# EAGLE design E104-BT11G-PCB (EAGLE 9.6.2)
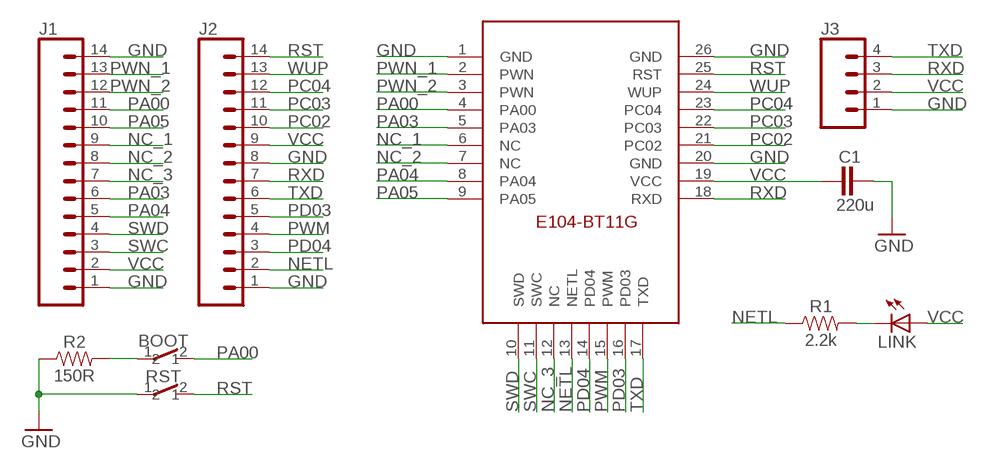
[diagram p0: schematic, sheet 1]

## Parts
BOOT  SKRKAEE010  [SKRK]
C1  220u  C_TANTALUM-1411(3528-METRIC)  [CAPM3528X210]
J1  CONN_14NO_SILK  [1X14_NO_SILK]
J2  CONN_14NO_SILK  [1X14_NO_SILK]
J3  CONN_041X04_NO_SILK  [1X04_NO_SILK]
LINK  LEDCHIP-LED0603  [CHIP-LED0603]
R1  2.2k  2.2KOHM-0603-1/10W-1%  [0603]
R2  150R  2.2KOHM-0603-1/10W-1%  [0603]
RST  SKRKAEE010  [SKRK]
U$1  E104-BT11G-PCBPCB  [E104-BT11G-PCB]

## Nets
GND: C1.2 J1.1 J1.14 J2.1 J2.8 J3.1 R2.1 RST.1 U$1.1(GND) U$1.20(GND) U$1.26(GND)
N$1: LINK.C R1.2
N$2: BOOT.1 R2.2
NC_1: J1.9 U$1.6(NC)
NC_2: J1.8 U$1.7(NC)
NC_3: J1.7 U$1.12(NC)
NETL: J2.2 R1.1 U$1.13(NETL)
PA00: BOOT.2 J1.11 U$1.4(PA00)
PA03: J1.6 U$1.5(PA03)
PA04: J1.5 U$1.8(PA04)
PA05: J1.10 U$1.9(PA05)
PC02: J2.10 U$1.21(PC02)
PC03: J2.11 U$1.22(PC03)
PC04: J2.12 U$1.23(PC04)
PD03: J2.5 U$1.16(PD03)
PD04: J2.3 U$1.14(PD04)
PWM: J2.4 U$1.15(PWM)
PWN_1: J1.13 U$1.2(PWN)
PWN_2: J1.12 U$1.3(PWN)
RST: J2.14 RST.2 U$1.25(RST)
RXD: J2.7 J3.3 U$1.18(RXD)
SWC: J1.3 U$1.11(SWC)
SWD: J1.4 U$1.10(SWD)
TXD: J2.6 J3.4 U$1.17(TXD)
VCC: C1.1 J1.2 J2.9 J3.2 LINK.A U$1.19(VCC)
WUP: J2.13 U$1.24(WUP)

## Library data of the parts
BOOT RST = button3:SKRKAEE010: Tactile Switches 3.9x2.9x2.0mm 160gf Packaging Temp 60oC <https://componentsearchengine.com/Images/1/SKRKAEE010.jpg> Source: Datasheet <http://www.mouser.com/ds/2/15/SKRK-1110686.pdf> Check availability <https://pricing.snapeda.com/parts/SKRKAEE010/ALPS/view-part?ref=eda>; AVAILABILITY: Not in stock; DESCRIPTION: Switch Tactile N.O. SPST Round Button Gull Wing 0.05A 12VDC 1.57N SMD T/R; MF: ALPS; MP: SKRKAEE010; PACKAGE: None; PRICE: None
C1 = Capacitor:C: Capacitor - Generic; CATEGORY: Capacitor
J1 J2 = SparkFun-Connectors:CONN_14: Multi connection point. Often used as Generic Header-pin footprint for 0.1 inch spaced/style header connections On any of the 0.1 inch spaced packages, you can populate with these: Break Away Headers - Straight <https://www.sparkfun.com/products/116> (PRT-00116) Break Away Male Headers - Right Angle <https://www.sparkfun.com/products/553> (PRT-00553) Female Headers <https://www.sparkfun.com/products/115> (PRT-00115) Break Away Headers - Machine Pin <https://www.sparkfun.com/products/117> (PRT-00117) Break Away Female Headers - Swiss Machine Pin <https://www.sparkfun.com/products/743> (PRT-00743) For SCREWTERMINALS and SPRING TERMINALS visit here: Screw Terimnals on SparkFun.com <https://www.sparkfun.com/search/results?term=Screw+Terminals> (5mm/3.5mm/2.54mm spacing) This device is also useful as a general connection point to wire up your design to another part of your project. Our various solder wires solder well into these plated through hole pads. Hook-Up Wire - Assortment (Stranded, 22 AWG) <https://www.sparkfun.com/products/11375> (PRT-11375) Hook-Up Wire - Assortment (Solid Core, 22 AWG) <https://www.sparkfun.com/products/11367> (PRT-11367) View the entire wire category on our website here <https://www.sparkfun.com/categories/141> Special notes: Molex polarized connector foot print use with SKU : PRT-08231 with associated crimp pins and housings. 1MM SMD Version SKU: PRT-10208 NOTES ON THE VARIANTS LOCK and LOCK_LONGPADS... This footprint was designed to help hold the alignment of a through-hole component (i.e. 6-pin header) while soldering it into place. You may notice that each hole has been shifted either up or down by 0.005 of an inch from it's more standard position (which is a perfectly straight line). This slight alteration caused the pins (the squares in the middle) to touch the edges of the holes. Because they are alternating, it causes a "brace" to hold the component in place. 0.005 has proven to be the perfect amount of "off-center" position when using our standard breakaway headers. Although looks a little odd when you look at the bare footprint, once you have a header in there, the alteration is very hard to notice. Also,if you push a header all the way into place, it is covered up entirely on the bottom side.
J3 = SparkFun-Connectors:CONN_04: Multi connection point. Often used as Generic Header-pin footprint for 0.1 inch spaced/style header connections On any of the 0.1 inch spaced packages, you can populate with these: Break Away Headers - Straight <https://www.sparkfun.com/products/116> (PRT-00116) Break Away Male Headers - Right Angle <https://www.sparkfun.com/products/553> (PRT-00553) Female Headers <https://www.sparkfun.com/products/115> (PRT-00115) Break Away Headers - Machine Pin <https://www.sparkfun.com/products/117> (PRT-00117) Break Away Female Headers - Swiss Machine Pin <https://www.sparkfun.com/products/743> (PRT-00743) For SCREWTERMINALS and SPRING TERMINALS visit here: Screw Terimnals on SparkFun.com <https://www.sparkfun.com/search/results?term=Screw+Terminals> (5mm/3.5mm/2.54mm spacing) This device is also useful as a general connection point to wire up your design to another part of your project. Our various solder wires solder well into these plated through hole pads. Hook-Up Wire - Assortment (Stranded, 22 AWG) <https://www.sparkfun.com/products/11375> (PRT-11375) Hook-Up Wire - Assortment (Solid Core, 22 AWG) <https://www.sparkfun.com/products/11367> (PRT-11367) View the entire wire category on our website here <https://www.sparkfun.com/categories/141> Special notes: Molex polarized connector foot print use with SKU : PRT-08231 with associated crimp pins and housings. 1MM SMD Version SKU: PRT-10208; PROD_ID: CONN-09696
LINK = adafruit:LED: LED OSRAM: - CHIPLED LG R971, LG N971, LY N971, LG Q971, LY Q971, LO R971, LY R971 LH N974, LH R974 LS Q976, LO Q976, LY Q976 LO Q996 - Hyper CHIPLED LW Q18S LB Q993, LB Q99A, LB R99A - SideLED LS A670, LO A670, LY A670, LG A670, LP A670 LB A673, LV A673, LT A673, LW A673 LH A674 LY A675 LS A676, LA A676, LO A676, LY A676, LW A676 LS A679, LY A679, LG A679 - Hyper Micro SIDELED® LS Y876, LA Y876, LO Y876, LY Y876 LT Y87S - SmartLED LW L88C, LW L88S LB L89C, LB L89S, LG L890 LS L89K, LO L89K, LY L89K LS L896, LA L896, LO L896, LY L896 - TOPLED LS T670, LO T670, LY T670, LG T670, LP T670 LSG T670, LSP T670, LSY T670, LOP T670, LYG T670 LG T671, LOG T671, LSG T671 LB T673, LV T673, LT T673, LW T673 LH T674 LS T676, LA T676, LO T676, LY T676, LB T676, LH T676, LSB T676, LW T676 LB T67C, LV T67C, LT T67C, LS T67K, LO T67K, LY T67K, LW E67C LS E67B, LA E67B, LO E67B, LY E67B, LB E67C, LV E67C, LT E67C LW T67C LS T679, LY T679, LG T679 LS T770, LO T770, LY T770, LG T770, LP T770 LB T773, LV T773, LT T773, LW T773 LH T774 LS E675, LA E675, LY E675, LS T675 LS T776, LA T776, LO T776, LY T776, LB T776 LHGB T686 LT T68C, LB T68C - Hyper Mini TOPLED® LB M676 - Mini TOPLED Santana® LG M470 LS M47K, LO M47K, LY M47K Source: http://www.osram.convergy.de/
R1 = SparkFun-Resistors:2.2KOHM: 2.2kΩ resistor A resistor is a passive two-terminal electrical component that implements electrical resistance as a circuit element. Resistors act to reduce current flow, and, at the same time, act to lower voltage levels within circuits. - Wikipedia; PROD_ID: RES-08272
R2 = SparkFun-Resistors:2.2KOHM: 2.2kΩ resistor A resistor is a passive two-terminal electrical component that implements electrical resistance as a circuit element. Resistors act to reduce current flow, and, at the same time, act to lower voltage levels within circuits. - Wikipedia; PROD_ID: RES-08272; VALUE: 2.2k
U$1 = E104-BT11G-PCB:E104-BT11G-PCB

## Board
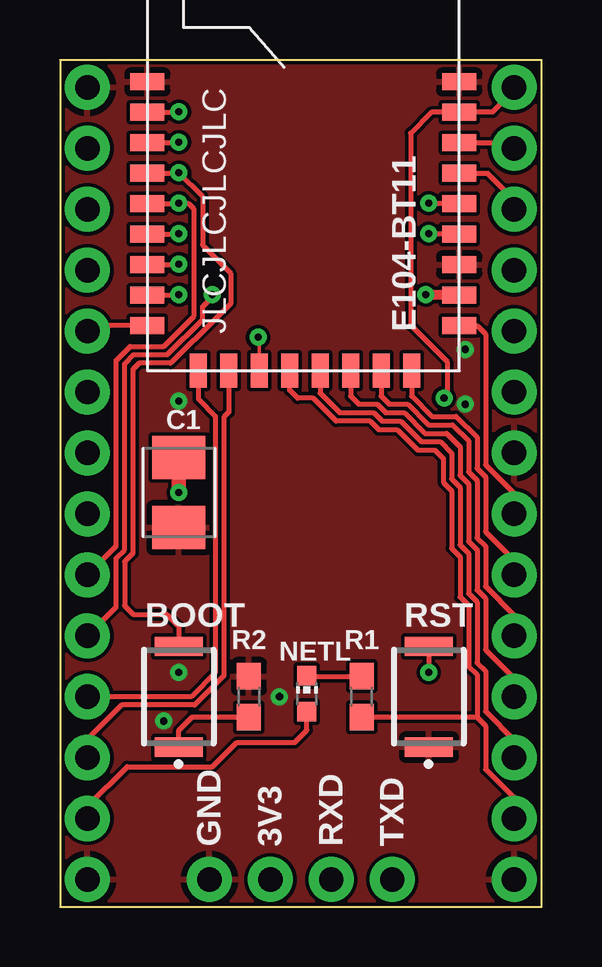
[diagram p1: board, top side]
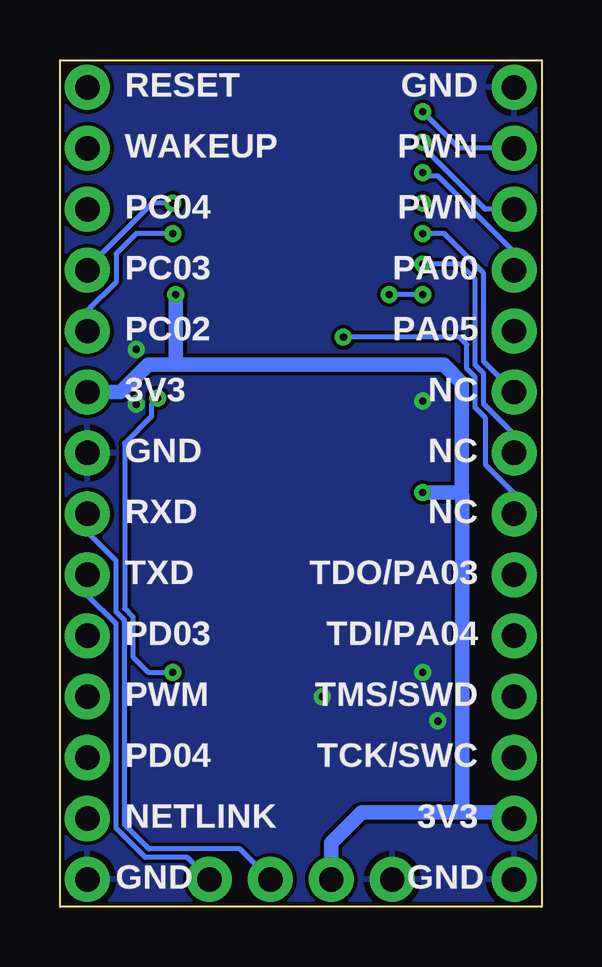
[diagram p2: board, bottom side, seen from below]

Size 20.07 x 35.31 mm. Coordinates in mm from the lower left corner, seen from the top.
Outline: 0,0 20.07,0 20.07,35.31 0,35.31 0,0
Copper layers (1*16): Top 0.035mm / dielectric 1.5mm / Bottom 0.035mm
Design rules "denis *": minimum track width 6mil, minimum drill 0.3mm, track to track 6mil, track to pad 6mil, pad to pad 6mil, via to via 6mil, smd to smd 6mil, copper to edge 6mil, drill to drill 0.3mm, minimum pad ring 10mil, minimum via ring 8mil, stop-mask expansion 2mil, vias tented up to drill 0.3mm, thermal gap 10mil

### Footprints (pad centres in the part's own frame; a part is rotated, then mirrored left to right if it is on the bottom)
SKRK = smd 0.8 x 2: 1 -2.1,0; 2 2.1,0
CAPM3528X210 = smd 1.796 x 2.204: 1 -1.46,0; 2 1.46,0
1X14_NO_SILK = drill 1.016 pad 1.88: 1 0,0; 2 2.54,0; 3 5.08,0; 4 7.62,0; 5 10.16,0; 6 12.7,0; 7 15.24,0; 8 17.78,0; 9 20.32,0; 10 22.86,0; 11 25.4,0; 12 27.94,0; 13 30.48,0; 14 33.02,0
1X04_NO_SILK = drill 1.016 pad 1.88: 1 0,0; 2 2.54,0; 3 5.08,0; 4 7.62,0
CHIP-LED0603 = smd 0.8 x 0.8: A 0,-0.75; C 0,0.75
0603 = smd 1.1 x 1: 1 -0.85,0; 2 0.85,0
E104-BT11G-PCB = smd 1.422 x 0.711: 1 -0.043,12.039; 2 -0.043,10.769; 3 -0.043,9.499; 4 -0.043,8.229; 5 -0.043,6.959; 6 -0.043,5.689; 7 -0.043,4.419; 8 -0.043,3.149; 9 -0.043,1.879; 18 12.954,1.879; 19 12.954,3.149; 20 12.954,4.419; 21 12.954,5.689; 22 12.954,6.959; 23 12.954,8.229; 24 12.954,9.499; 25 12.954,10.769; 26 12.954,12.039 | smd 0.711 x 1.422: 10 2.079,0; 11 3.349,0; 12 4.619,0; 13 5.889,0; 14 7.159,0; 15 8.429,0; 16 9.699,0; 17 10.969,0

### Placement (x,y rotation side)
BOOT  4.95,8.76 90 top
C1  4.95,17.27 270 top
J1  1.14,1.14 90 top
J2  18.92,1.14 90 top
J3  6.22,1.14 0 top
LINK  10.29,8.89 0 top
R1  12.57,8.76 90 top
R2  7.87,8.76 270 top
RST  15.37,8.76 90 top
U$1  3.68,22.35 0 top

### Tracks (layer width: path | path; a pad name or v marks a point on that pad's centre or on a via)
GND  (via drill 0.3)
  other vias: 16.89,20.95 16.89,23.24 4.95,21.08 4.32,7.75 4.95,9.78 9.14,8.76
  pour Top: 20.83,-0.38 20.83,35.81 -0.76,35.81 -0.76,-0.38
  pour Bottom: 20.83,-0.38 20.83,35.94 -0.76,35.94 -0.76,-0.38
N$1
  Top 0.2: LINK.C 10.31,9.61 R1.2
N$2
  Top 0.2: BOOT.1 4.95,7.37 5.5,7.91 R2.2
NC_1  (via drill 0.3)
  Top 0.2: U$1.6 4.93,28.04 v4.95,28.07
  Bottom 0.2: J1.9 2.41,22.73 2.41,26.42 4.06,28.07 v4.95,28.07
NC_2  (via drill 0.3)
  Top 0.2: U$1.7 4.93,26.77 v4.95,26.8
  Bottom 0.2: J1.8 1.14,19.68 2.41,20.95 2.41,22.23 2.77,22.59 2.77,26.16 3.4,26.8 v4.95,26.8
NC_3  (via drill 0.3)
  Top 0.152: U$1.12 8.3,23.7 v8.26,23.75
  Bottom 0.2: J1.7 1.14,17.24 2.33,18.43 2.33,20.38 2.77,20.81 2.77,22.09 3.12,22.44 3.12,23.44 3.43,23.75 v8.26,23.75
NETL
  Top 0.2: 17.38,7.89 17.73,7.54 17.73,5.73 18.92,4.54 J2.2 | 17.38,7.89 17.38,9.68 17.03,10.04 17.03,12.56 16.67,12.91 16.67,14.6 16.32,14.95 16.32,17.35 15.97,17.7 15.97,18.69 15.62,19.04 14.91,19.04 14.05,19.9 13.28,19.9 12.93,20.25 11.51,20.25 10.55,21.21 9.91,21.21 9.57,21.54 U$1.13 | R1.1 17.36,7.91 17.38,7.89
PA00  (via drill 0.3)
  Top 0.2: U$1.4 4.93,30.58 v4.95,30.61 5.94,29.62 5.94,27.59 7.11,26.42 7.11,25.15 5.59,23.62 5.57,23.62 4.61,22.66 3.3,22.66 3.04,22.4 3.04,14.74 2.69,14.39 2.69,12.55 3.05,12.19 4.45,12.19 4.95,11.68 BOOT.2
  Bottom 0.2: v4.95,30.61 4.83,30.48 4.32,30.48 1.02,27.18 1.02,26.54 J1.11
PA03  (via drill 0.3)
  Top 0.2: U$1.5 4.93,29.31 | 4.93,29.31 v4.95,29.34 | J1.6 2.33,15.04 2.33,22.78 2.92,23.37 4.32,23.37 5.59,24.64 5.59,29.08 5.36,29.31 4.93,29.31
PA04  (via drill 0.3)
  Top 0.2: U$1.8 4.93,25.5 v4.95,25.53 | J1.5 2.33,12.49 2.33,14.54 2.69,14.89 2.69,22.64 3.07,23.02 4.46,23.02 5.94,24.49 5.94,25.02 6.35,25.43 v6.35,25.53
  Bottom 0.2: v4.95,25.53 v6.35,25.53
PA05
  Top 0.2: U$1.9 1.37,24.23 J1.10
PC02  (via drill 0.3)
  Top 0.2: U$1.21 15.39,28.04 v15.37,28.07
  Bottom 0.2: v15.37,28.07 16.89,28.07 17.73,27.23 17.73,26.05 18.92,24.86 J2.10
PC03  (via drill 0.3)
  Top 0.2: U$1.22 15.39,29.31 v15.37,29.34
  Bottom 0.2: v15.37,29.34 16.22,29.34 18.92,26.64 J2.11
PC04
  Top 0.2: U$1.23 17.81,30.58 18.92,29.46 J2.12
PD03
  Top 0.2: U$1.16 13.38,21.29 13.72,20.95 14.49,20.95 15.35,20.09 16.36,20.09 17.03,19.43 17.03,18.14 17.38,17.79 17.38,15.39 17.73,15.04 17.73,13.35 18.92,12.16 J2.5
PD04
  Top 0.2: U$1.14 10.84,21.42 11.65,20.6 13.07,20.6 13.42,20.25 14.2,20.25 15.06,19.39 15.84,19.39 16.32,18.9 16.32,17.84 16.67,17.49 16.67,15.1 17.03,14.74 17.03,13.06 17.38,12.71 17.38,10.18 17.73,9.83 17.73,8.14 18.92,6.95 J2.3
PWM
  Top 0.2: U$1.15 12.11,21.29 12.45,20.95 13.22,20.95 13.57,20.6 14.34,20.6 15.2,19.74 16.11,19.74 16.67,19.18 16.67,17.99 17.03,17.64 17.03,15.24 17.38,14.89 17.38,13.2 17.73,12.85 17.73,10.72 18.92,9.53 J2.4
PWN_1  (via drill 0.3)
  Top 0.2: U$1.2 4.93,33.12 v4.95,33.15
  Bottom 0.2: v4.95,33.15 3.43,31.62 J1.13
PWN_2  (via drill 0.3)
  Top 0.2: U$1.3 4.93,31.85 v4.95,31.88
  Bottom 0.2: J1.12 2.34,29.08 4.95,31.69 v4.95,31.88
RST  (via drill 0.3)
  Top 0.2: J2.14 18.92,34.04 18.03,33.15 16.66,33.15 U$1.25 15.47,33.12 14.61,32.26 14.61,24.26 16.13,22.73 16.13,21.34 v16,21.21 | RST.2 v15.37,9.78
  Bottom 0.2: v16,21.21 16.26,20.95 16.26,20.45 17.38,19.32 17.38,12.44 17.03,12.09 17.03,10.42 16.38,9.78 v15.37,9.78
RXD
  Top 0.2: U$1.18 17.38,24.23 17.73,23.88 17.73,18.43 18.92,17.24 J2.7
  Bottom 0.2: J3.3 12.57,2.41 16.36,2.41 17.38,3.43 17.38,11.94 17.73,12.29 17.73,14.43 19.05,15.75 19.05,16.26 J2.7
SWC
  Top 0.2: J1.3 1.14,6.99 2.57,8.41 5.61,8.41 6.83,9.63 6.83,20.42 7.03,20.62 U$1.11
SWD
  Top 0.2: U$1.10 5.76,21.16 6.48,20.45 6.48,9.78 5.46,8.76 J1.4
TXD
  Top 0.2: U$1.17 14.65,21.29 15.49,20.45 16.51,20.45 17.38,19.58 17.38,18.28 17.73,17.93 17.73,15.63 18.92,14.44 J2.6
  Bottom 0.2: J2.6 18.92,12.99 17.73,11.8 17.73,3.28 16.51,2.06 14.76,2.06 J3.4
VCC  (via drill 0.3)
  Top 0.2: C1.1 4.95,18.41 | J1.2 1.14,4.19 2.79,5.84 6.35,5.84 7.37,6.86 9.78,6.86 10.29,7.37 LINK.A
  Top 0.406: U$1.19 15.27,25.5 v15.24,25.53
  Top 0.61: 4.95,18.41 v4.95,17.27
  Bottom 0.61: J3.2 8.76,2.67 7.49,3.94 3.3,3.94 | 3.3,3.94 1.4,3.94 J1.2 | 15.24,22.61 4.08,22.61 3.32,21.84 3.32,17.38 3.43,17.27 | 15.24,22.61 16.39,22.61 17.53,21.46 J2.9 | v15.24,25.53 15.24,22.61 | v4.95,17.27 3.43,17.27 | 3.43,17.27 3.3,17.14 3.3,3.94
WUP
  Top 0.2: U$1.24 18.7,31.85 J2.13

### Text on the board
tNames: JLCJLCJLCJLC | E104-BT11 | C1 | BOOT | RST | NETL | GND | 3V3 | RXD | TXD
bNames: GND | RESET | PWN | WAKEUP | PWN | PC04 | PA00 | PC03 | PA05 | PC02 | NC | 3V3 | NC | GND | NC | RXD | TDO/PA03 | TXD | TDI/PA04 | PD03 | TMS/SWD | PWM | TCK/SWC | PD04 | 3V3 | NETLINK | GND | GND